# Altium schematic sheet NTC.SchDoc
size 420 x 297 mm; SheetNumber: 34; SheetTotal: 34
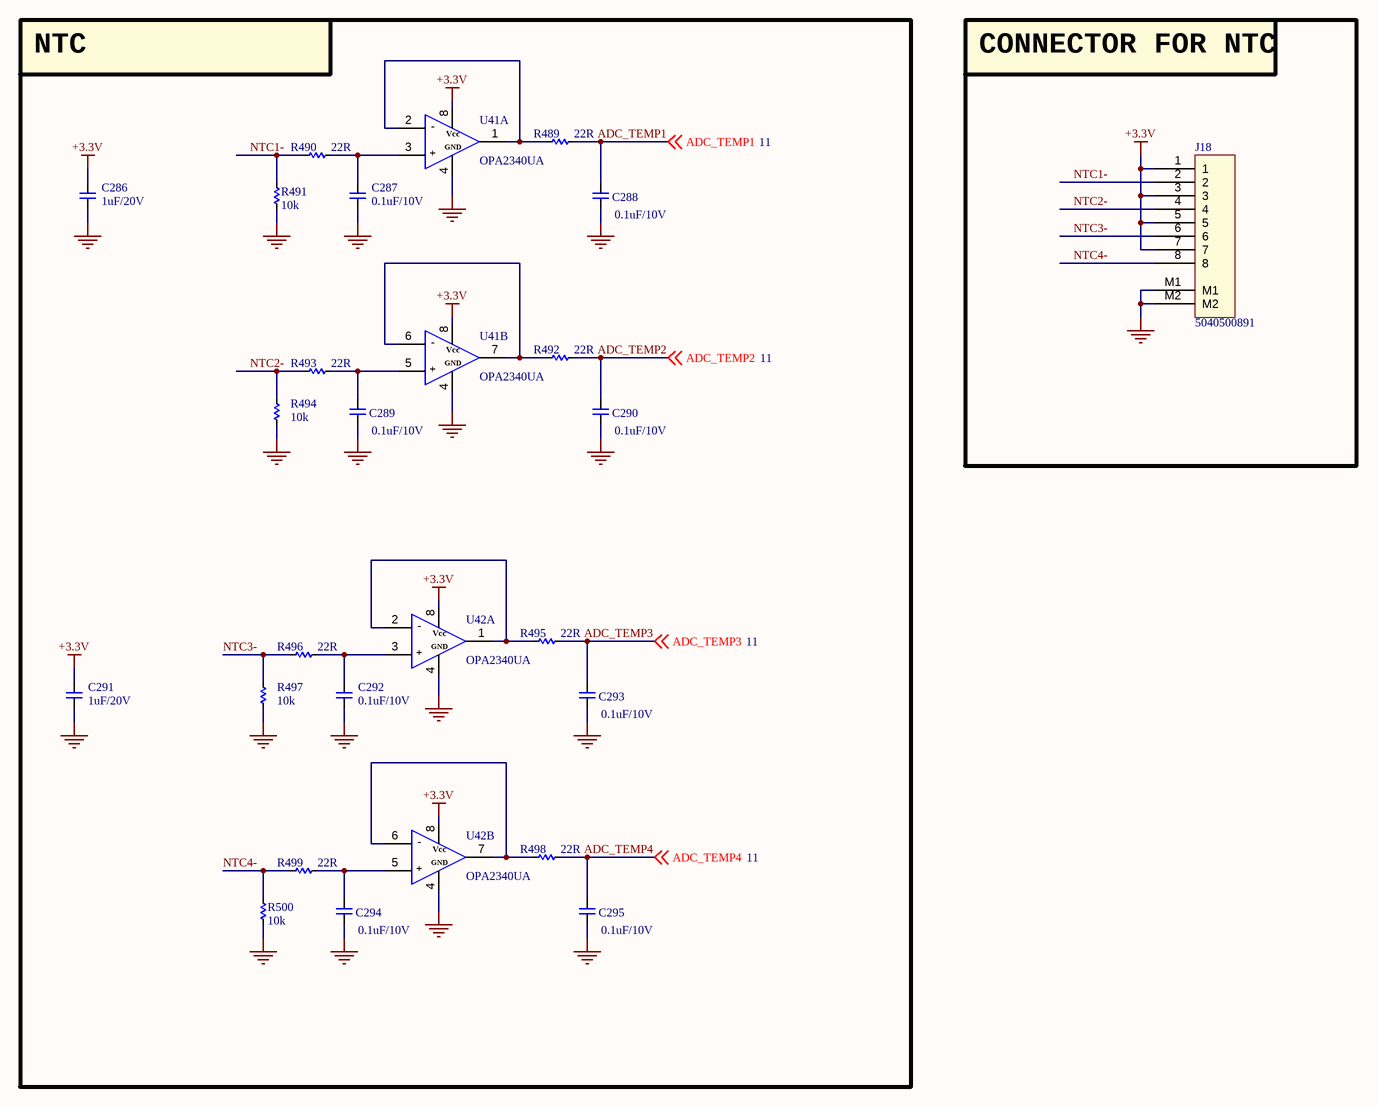
[diagram p0: NTC.SchDoc]

## Parts
C286  1uF/20V  [CAP_C_1005X60]
C287  0.1uF/10V  [CAP_C_1005X50_L]
C288  0.1uF/10V  [CAP_C_1005X50_L]
C289  0.1uF/10V  [CAP_C_1005X50_L]
C290  0.1uF/10V  [CAP_C_1005X50_L]
C291  1uF/20V  [CAP_C_1005X60]
C292  0.1uF/10V  [CAP_C_1005X50_L]
C293  0.1uF/10V  [CAP_C_1005X50_L]
C294  0.1uF/10V  [CAP_C_1005X50_L]
C295  0.1uF/10V  [CAP_C_1005X50_L]
J18  5040500891  [MOLEX_5040500891]
R489  22R  [RES_C_1005X40]
R490  22R  [RES_C_1005X40]
R491  10k  [RES_C_1005X40]
R492  22R  [RES_C_1005X40]
R493  22R  [RES_C_1005X40]
R494  10k  [RES_C_1005X40]
R495  22R  [RES_C_1005X40]
R496  22R  [RES_C_1005X40]
R497  10k  [RES_C_1005X40]
R498  22R  [RES_C_1005X40]
R499  22R  [RES_C_1005X40]
R500  10k  [RES_C_1005X40]
U41  OPA2340UA  [SOIC127P602X173-8N]  (parts A,B of 2)
U42  OPA2340UA  [SOIC127P602X173-8N]  (parts A,B of 2)

## Blocks framed on the sheet
NTC: C286-C295 R489-R500 U41 U42
CONNECTOR FOR NTC: J18

## Nets
+3.3V: C286.2 C291.2 J18.1 J18.3 J18.5 J18.7 U41.8 U42.8
GND: C286.1 C287.1 C288.1 C289.1 C290.1 C291.1 C292.1 C293.1 C294.1 C295.1 J18.M1 J18.M2 R491.1 R494.1 R497.1 R500.1 U41.4 U42.4
ADC_TEMP1: C288.2 R489.2 ; off-sheet ADC_TEMP1
ADC_TEMP2: C290.2 R492.2 ; off-sheet ADC_TEMP2
ADC_TEMP3: C293.2 R495.2 ; off-sheet ADC_TEMP3
ADC_TEMP4: C295.2 R498.2 ; off-sheet ADC_TEMP4
NTC1-: J18.2 R490.1 R491.2
NTC2-: J18.4 R493.1 R494.2
NTC3-: J18.6 R496.1 R497.2
NTC4-: J18.8 R499.1 R500.2
NetC287_2: C287.2 R490.2 U41.3
NetC289_2: C289.2 R493.2 U41.5
NetC292_2: C292.2 R496.2 U42.3
NetC294_2: C294.2 R499.2 U42.5
NetR489_1: R489.1 U41.1 U41.2
NetR492_1: R492.1 U41.6 U41.7
NetR495_1: R495.1 U42.1 U42.2
NetR498_1: R498.1 U42.6 U42.7

## Notes on the sheet
- Project:
- Sub-system:
- Design by:
- Sheet title:
- Sheet
- of
- Checked by:
- Approved by:
- Revision:
- Document No:
- Size:
- Date:
- A3
- (in symbol OPA2340UA, part A) -; Vcc; GND; +
- (in symbol OPA2340UA, part B) -; Vcc; GND; +

## Library data of the parts
C286-C295 = _CAP_C_2: CAP
J18 = Header 8x1_2M
R489-R500 = _RES_B_2: RES